# Altium schematic sheet power.SchDoc
size A4
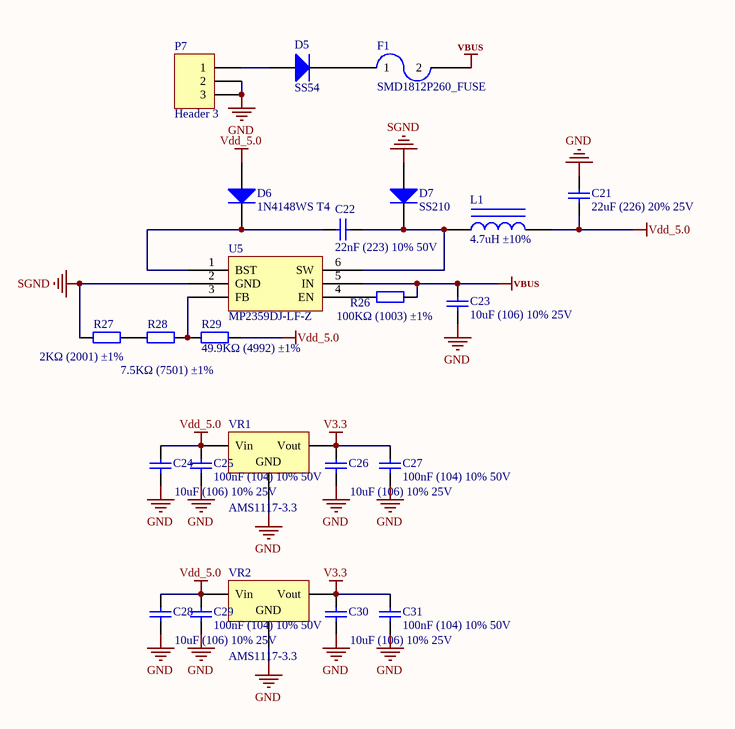
[diagram p0: power.SchDoc]

## Parts
C21  22uF (226) 20% 25V  [0805_C]
C22  22nF (223) 10% 50V  [0603_C]
C23  10uF (106) 10% 25V  [0805_C]
C24  10uF (106) 10% 25V  [0805_C]
C25  100nF (104) 10% 50V  [0603_C]
C26  10uF (106) 10% 25V  [0805_C]
C27  100nF (104) 10% 50V  [0603_C]
C28  10uF (106) 10% 25V  [0805_C]
C29  100nF (104) 10% 50V  [0603_C]
C30  10uF (106) 10% 25V  [0805_C]
C31  100nF (104) 10% 50V  [0603_C]
D5  SS54  [SMA(DO-214AC)_S1]
D6  1N4148WS T4  [SOD-323]
D7  SS210  [SMA(DO-214AC)_S1]
F1  SMD1812P260_FUSE  [SMD1812P260]
L1  4.7uH ±10%  [L_4030]
P7  Header 3  [DC-005]
R26  100KΩ (1003) ±1%  [0603_R]
R27  2KΩ (2001) ±1%  [0603_R]
R28  7.5KΩ (7501) ±1%  [0603_R]
R29  49.9KΩ (4992) ±1%  [0603_R]
U5  MP2359DJ-LF-Z  [SOT-23-6]
VR1  AMS1117-3.3  [SOT-223]
VR2  AMS1117-3.3  [SOT-223]

## Nets
GND: C21.2 C23.1 C24.1 C25.1 C26.1 C27.1 C28.1 C29.1 C30.1 C31.1 P7.2 P7.3 VR1.1(GND) VR2.1(GND)
SGND: D7.1(A) R27.2 U5.2(GND)
V3.3: C26.2 C27.2 C30.2 C31.2 VR1.2(Vout) VR2.2(Vout)
VBUS: C23.2 F1.2 R26.2 U5.5(IN)
Vdd_5.0: C21.1 C24.2 C25.2 C28.2 C29.2 D6.1(A) L1.2 R29.2 VR1.3(Vin) VR2.3(Vin)
NetC22_1: C22.1 D6.2(K) U5.1(BST)
NetC22_2: C22.2 D7.2(K) L1.1 U5.6(SW)
NetD5_1: D5.1(A) P7.1
NetD5_2: D5.2(K) F1.1
NetR26_1: R26.1 U5.4(EN)
NetR27_1: R27.1 R28.2
NetR28_1: R28.1 R29.1 U5.3(FB)

## Library data of the parts
C21 = 0805 22uF (226) 20% 25V: 贴片电容; ComponentLink1Description: 供应商链接; ComponentLink1URL: http://www.szlcsc.com/product/details_46786.html; Package: 0805; Supplier: LC; SuppliersPartNumber: C45783
C22 = 0603 22nF (223) 10% 50V: 贴片电容; ComponentLink1Description: 供应商链接; ComponentLink1URL: http://www.szlcsc.com/product/details_21834.html; Package: 0603; Supplier: LC; SuppliersPartNumber: C21122
C23 C24 C26 C28 C30 = 0805 10uF (106) 10% 25V: 贴片电容; ComponentLink1Description: 供应商链接; ComponentLink1URL: http://www.szlcsc.com/product/details_16532.html; Package: 0805; Supplier: LC; SuppliersPartNumber: C15850
C25 C27 C29 C31 = 0603 100nF (104) 10% 50V: 贴片电容; ComponentLink1Description: 供应商链接; ComponentLink1URL: http://www.szlcsc.com/product/details_15331.html; Package: 0603; Supplier: LC; SuppliersPartNumber: C14663
D5 = SMA(DO-214AC) SS54: 二极管; ComponentLink1Description: 供应商链接; ComponentLink1URL: http://www.szlcsc.com/product/details_23178.html; Package: SMA(DO-214AC); Supplier: LC; SuppliersPartNumber: C22452
D6 = SOD-323 1N4148WS T4: 二极管; ComponentLink1Description: 供应商链接; ComponentLink1URL: http://www.szlcsc.com/product/details_2485.html; Package: SOD-323; Supplier: LC; SuppliersPartNumber: C2128
D7 = SMA(DO-214AC) SS210: 二极管; ComponentLink1Description: 供应商链接; ComponentLink1URL: http://www.szlcsc.com/product/details_15669.html; Package: SMA(DO-214AC); Supplier: LC; SuppliersPartNumber: C14996
L1 = 0603 4.7uH 10%: 贴片电感; ComponentLink1Description: 供应商链接; ComponentLink1URL: http://www.szlcsc.com/product/details_1386.html; Package: 0603; Supplier: LC; SuppliersPartNumber: C1034
P7 = Header 3: Header, 3-Pin; LatestRevisionDate: 17-Jul-2002; LatestRevisionNote: Re-released for DXP Platform.; Publisher: Altium Limited
R26 = 0603 100KΩ (1003) 1%: 贴片电阻; ComponentLink1Description: 供应商链接; ComponentLink1URL: http://www.szlcsc.com/product/details_26546.html; Package: 0603; Supplier: LC; SuppliersPartNumber: C25803
R27 = 0603 2KΩ (2001) 1%: 贴片电阻; ComponentLink1Description: 供应商链接; ComponentLink1URL: http://www.szlcsc.com/product/details_23702.html; Package: 0603; Supplier: LC; SuppliersPartNumber: C22975
R28 = 0603 7.5KΩ (7501) 1%: 贴片电阻; ComponentLink1Description: 供应商链接; ComponentLink1URL: http://www.szlcsc.com/product/details_23961.html; Package: 0603; Supplier: LC; SuppliersPartNumber: C23234
R29 = 0603 49.9KΩ (4992) 1%: 贴片电阻; ComponentLink1Description: 供应商链接; ComponentLink1URL: http://www.szlcsc.com/product/details_23911.html; Package: 0603; Supplier: LC; SuppliersPartNumber: C23184
U5 = MP2359DJ-LF-Z_[C14259]: DC-DC芯片; ComponentLink1Description: 供应商链接; ComponentLink1URL: http://www.szlcsc.com/product/details_14917.html; Package: SOT-23-6; Supplier: LC; SuppliersPartNumber: C14259
VR1 VR2 = SOT-223 AMS1117-3.3: 低压差线性稳压(LDO); ComponentLink1Description: 供应商链接; ComponentLink1URL: http://www.szlcsc.com/product/details_6652.html; Package: SOT-223; Supplier: LC; SuppliersPartNumber: C6186